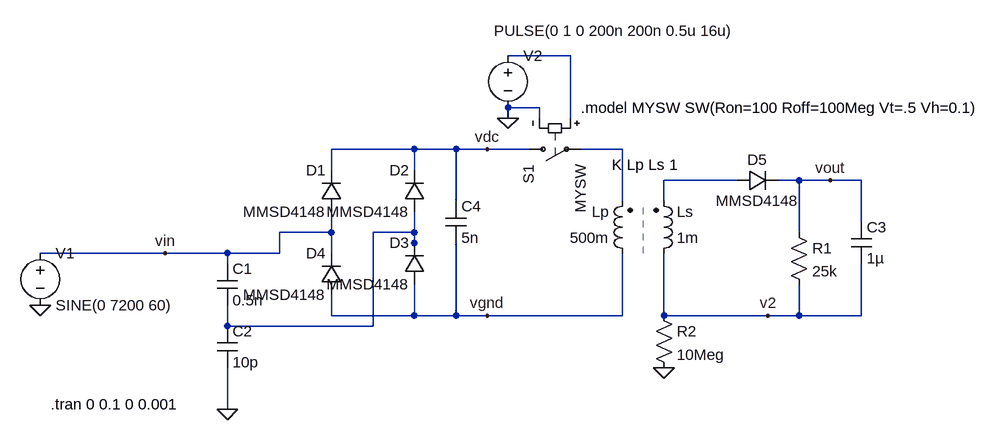
[diagram p0: schematic circuit3.asc]
circuit3.asc, the LTspice schematic file:
Version 4
SHEET 1 1680 680
WIRE 928 -144 832 -144
WIRE 880 -64 832 -64
WIRE 832 -48 832 -64
WIRE 880 -48 880 -64
WIRE 928 -48 928 -144
WIRE 688 0 560 0
WIRE 752 0 688 0
WIRE 800 0 752 0
WIRE 864 0 800 0
WIRE 1008 0 944 0
WIRE 560 32 560 0
WIRE 688 32 688 0
WIRE 1184 48 1072 48
WIRE 1280 48 1248 48
WIRE 1328 48 1280 48
WIRE 1376 48 1328 48
WIRE 752 80 752 0
WIRE 1008 80 1008 0
WIRE 1072 80 1072 48
WIRE 1376 112 1376 48
WIRE 560 128 560 96
WIRE 560 128 480 128
WIRE 688 128 688 96
WIRE 688 128 624 128
WIRE 1280 128 1280 48
WIRE 688 144 688 128
WIRE 304 160 112 160
WIRE 400 160 304 160
WIRE 480 160 480 128
WIRE 480 160 400 160
WIRE 560 160 560 128
WIRE 688 160 688 144
WIRE 400 176 400 160
WIRE 560 256 560 224
WIRE 688 256 688 208
WIRE 688 256 560 256
WIRE 752 256 752 144
WIRE 752 256 688 256
WIRE 800 256 752 256
WIRE 1008 256 1008 160
WIRE 1008 256 800 256
WIRE 1072 256 1072 160
WIRE 1232 256 1072 256
WIRE 1280 256 1280 208
WIRE 1280 256 1232 256
WIRE 1376 256 1376 176
WIRE 1376 256 1280 256
WIRE 400 272 400 240
WIRE 624 272 624 128
WIRE 624 272 400 272
WIRE 400 400 400 336
FLAG 112 240 0
FLAG 400 400 0
FLAG 304 160 vin
FLAG 800 256 vgnd
FLAG 1328 48 vout
FLAG 800 0 vdc
FLAG 832 -48 0
FLAG 1232 256 v2
FLAG 1072 336 0
SYMBOL voltage 112 144 R0
WINDOW 123 0 0 Left 0
WINDOW 39 24 124 Left 2
SYMATTR InstName V1
SYMATTR Value SINE(0 7200 60)
SYMBOL cap 384 272 R0
SYMATTR InstName C2
SYMATTR Value 10p
SYMBOL ind2 1024 176 R180
WINDOW 0 36 80 Left 2
WINDOW 3 36 40 Left 2
SYMATTR InstName Lp
SYMATTR Value 500m
SYMATTR Type ind
SYMATTR SpiceLine Rser=3
SYMBOL ind2 1056 176 M180
WINDOW 0 36 80 Left 2
WINDOW 3 36 40 Left 2
SYMATTR InstName Ls
SYMATTR Value 1m
SYMATTR Type ind
SYMATTR SpiceLine Rser=0.002
SYMBOL res 1264 112 R0
SYMATTR InstName R1
SYMATTR Value 25k
SYMBOL cap 1360 112 R0
SYMATTR InstName C3
SYMATTR Value 1µ
SYMBOL cap 736 80 R0
SYMATTR InstName C4
SYMATTR Value 5n
SYMBOL diode 576 96 R180
WINDOW 0 24 64 Left 2
WINDOW 3 24 0 Left 2
SYMATTR InstName D1
SYMATTR Value MMSD4148
SYMBOL diode 704 96 R180
WINDOW 0 24 64 Left 2
WINDOW 3 24 0 Left 2
SYMATTR InstName D2
SYMATTR Value MMSD4148
SYMBOL diode 704 208 R180
WINDOW 0 24 64 Left 2
WINDOW 3 24 0 Left 2
SYMATTR InstName D3
SYMATTR Value MMSD4148
SYMBOL diode 576 224 R180
WINDOW 0 24 64 Left 2
WINDOW 3 24 0 Left 2
SYMATTR InstName D4
SYMATTR Value MMSD4148
SYMBOL sw 848 0 M90
SYMATTR InstName S1
SYMATTR Value MYSW
SYMBOL voltage 832 -160 R0
WINDOW 123 0 0 Left 0
WINDOW 39 0 0 Left 0
WINDOW 3 -22 -22 Left 2
SYMATTR Value PULSE(0 1 0 200n 200n 0.5u 16u)
SYMATTR InstName V2
SYMBOL diode 1184 32 M90
WINDOW 0 0 32 VBottom 2
WINDOW 3 32 32 VTop 2
SYMATTR InstName D5
SYMATTR Value MMSD4148
SYMBOL res 1056 240 R0
SYMATTR InstName R2
SYMATTR Value 10Meg
SYMBOL cap 384 176 R0
SYMATTR InstName C1
SYMATTR Value 0.5n
TEXT 128 392 Left 2 !.tran 0 0.1 0 0.001
TEXT 992 24 Left 2 !K Lp Ls 1
TEXT 944 -64 Left 2 !.model MYSW SW(Ron=100 Roff=100Meg Vt=.5 Vh=0.1)
LINE Normal 1040 160 1040 80 2

The netlist it stands for:
* circuit3.asc
V1 vin 0 SINE(0 7200 60)
C2 N004 0 10p
Lp vgnd N002 500m Rser=3
Ls v2 N003 1m Rser=0.002
R1 vout v2 25k
C3 vout v2 1µ
C4 vdc vgnd 5n
D1 vin vdc MMSD4148
D2 N004 vdc MMSD4148
D3 vgnd N004 MMSD4148
D4 vgnd vin MMSD4148
S1 vdc N002 N001 0 MYSW
V2 N001 0 PULSE(0 1 0 200n 200n 0.5u 16u)
D5 N003 vout MMSD4148
R2 v2 0 10Meg
C1 vin N004 0.5n
.model D D
.lib standard.dio
.tran 0 0.1 0 0.001
K Lp Ls 1
.model MYSW SW(Ron=100 Roff=100Meg Vt=.5 Vh=0.1)
.backanno
.end